# EAGLE design ROwen_main (EAGLE 7.2.0)

## Sheet 1 of 4
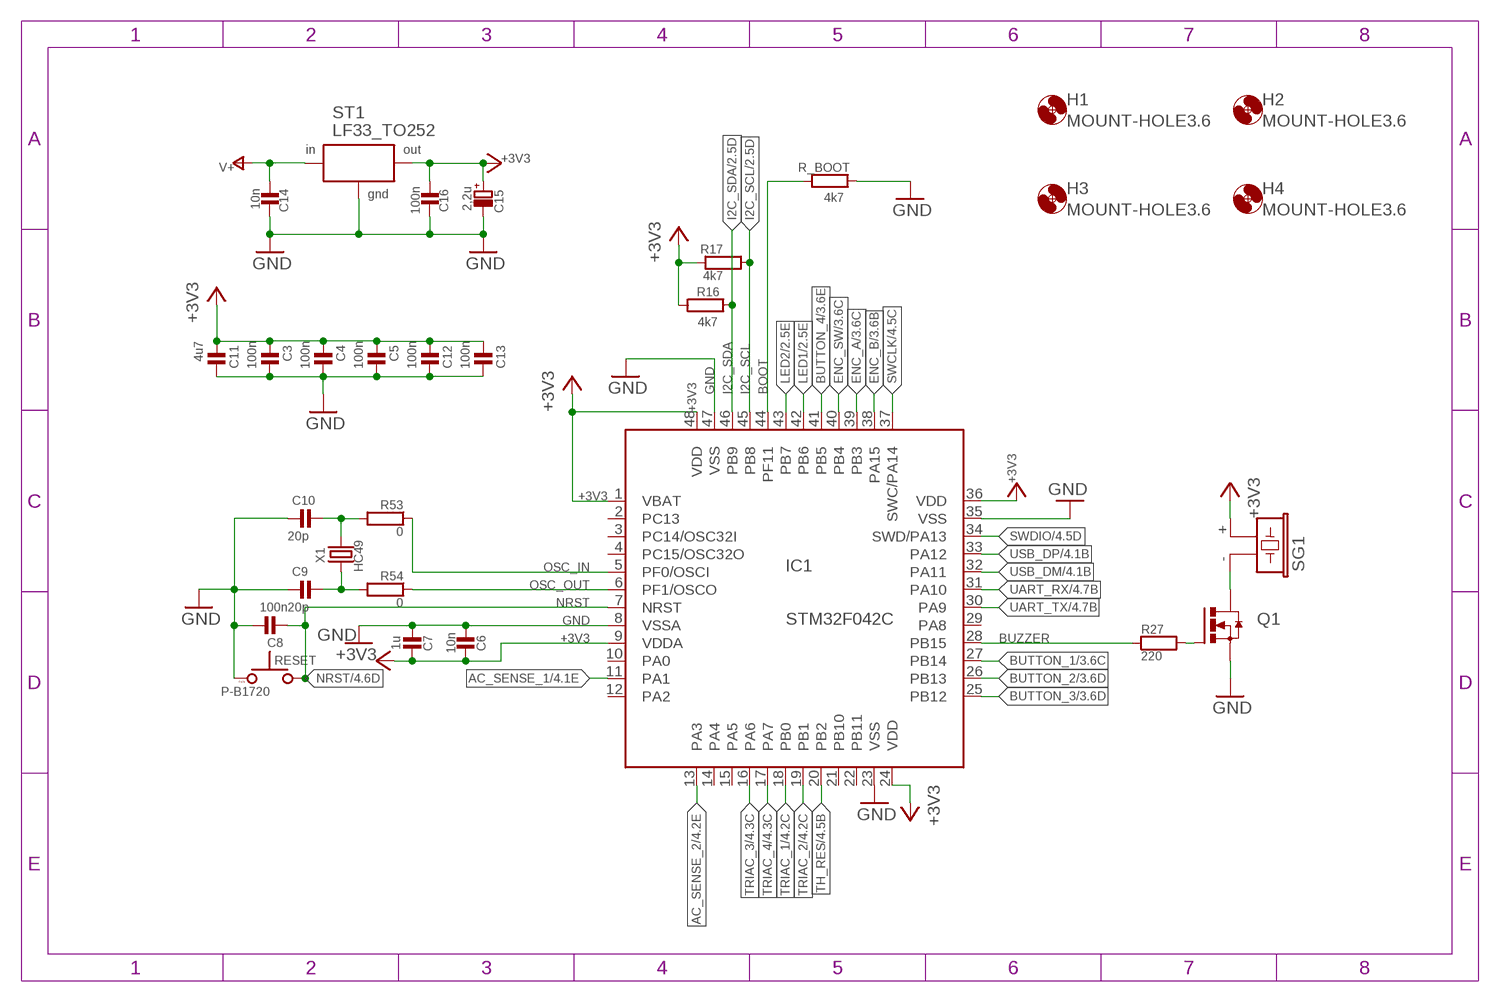
[diagram p0: schematic, sheet 1]

### Parts
C3  100n  C0603  [0603]
C4  100n  C0603  [0603]
C5  100n  C0603  [0603]
C6  10n  C0603  [0603]
C7  1u  C0603  [0603]
C8  100n  C0603  [0603]
C9  20p  C0603  [0603]
C10  20p  C0603  [0603]
C11  4u7  C0603  [0603]
C12  100n  C0603  [0603]
C13  100n  C0603  [0603]
C14  10n  C0603  [0603]
C15  2,2u  CEE5-8.5  [ER_08,5_05]
C16  100n  C0603  [0603]
H1  MOUNT-HOLE3.6  [3,6]
H2  MOUNT-HOLE3.6  [3,6]
H3  MOUNT-HOLE3.6  [3,6]
H4  MOUNT-HOLE3.6  [3,6]
IC1  STM32F042C  [LQFP48]
Q1  N-HEXFET-2D_SOT232-IRLL014N  [SOT223]
R16  4k7  R_R0603  [0603]
R17  4k7  R_R0603  [0603]
R27  220  R_R0603  [0603]
R53  0  R_R0603  [0603]
R54  0  R_R0603  [0603]
R_BOOT  4k7  R_R0603  [0603]
RESET  P-B1720  [P-B1720]
SG1  F/CM12P  [F/CM12P]
ST1  LF33_TO252  [DPACK]
X1  HC49  XHC49  [X_HC49/S]

### Nets
+3V3: C3.2 C4.2 C5.2 C6.1 C7.1 C11.2 C12.2 C13.2 C15.+ C16.2 IC1.1(VBAT) IC1.9(VDDA) IC1.24(VDD) IC1.36(VDD) IC1.48(VDD) R16.2 R17.2 SG1.+ ST1.3(OUT) ; also sheet 2,3,4
AC_SENSE_1: IC1.11(PA1) ; also sheet 4
AC_SENSE_2: IC1.13(PA3) ; also sheet 4
BOOT: IC1.44(PF11) R_BOOT.2
BUTTON_1: IC1.27(PB14) ; also sheet 3
BUTTON_2: IC1.26(PB13) ; also sheet 3
BUTTON_3: IC1.25(PB12) ; also sheet 3
BUTTON_4: IC1.41(PB5) ; also sheet 3
BUZZER: IC1.28(PB15) R27.1
ENC_A: IC1.39(PB3) ; also sheet 3
ENC_B: IC1.38(PA15) ; also sheet 3
ENC_SW: IC1.40(PB4) ; also sheet 3
GND: C3.1 C4.1 C5.1 C6.2 C7.2 C8.1 C9.2 C10.2 C11.1 C12.1 C13.1 C14.2 C15.- C16.1 IC1.8(VSSA) IC1.23(VSS) IC1.35(VSS) IC1.47(VSS) Q1.3(S) R_BOOT.1 RESET.1 ST1.2(GND) ; also sheet 2,3,4
I2C_SCL: IC1.45(PB8) R17.1 ; also sheet 2,4
I2C_SDA: IC1.46(PB9) R16.1 ; also sheet 2,4
LED1: IC1.42(PB6) ; also sheet 2
LED2: IC1.43(PB7) ; also sheet 2
N$78: Q1.2(D) Q1.4(D) SG1.-
N$79: Q1.1(G) R27.2
N$82: C9.1 R54.2 X1.1
N$85: C10.1 R53.2 X1.2
NRST: C8.2 IC1.7(NRST) RESET.2 ; also sheet 4
OSC_IN: IC1.5(PF0/OSCI) R53.1
OSC_OUT: IC1.6(PF1/OSCO) R54.1
SWCLK: IC1.37(SWC/PA14) ; also sheet 4
SWDIO: IC1.34(SWD/PA13) ; also sheet 4
TH_RES: IC1.20(PB2) ; also sheet 4
TRIAC_1: IC1.18(PB0) ; also sheet 4
TRIAC_2: IC1.19(PB1) ; also sheet 4
TRIAC_3: IC1.16(PA6) ; also sheet 4
TRIAC_4: IC1.17(PA7) ; also sheet 4
UART_RX: IC1.31(PA10) ; also sheet 4
UART_TX: IC1.30(PA9) ; also sheet 4
USB_DM: IC1.32(PA11) ; also sheet 4
USB_DP: IC1.33(PA12) ; also sheet 4
V+: C14.1 ST1.1(IN) ; also sheet 4
Unconnected: IC1.2(PC13) IC1.3(PC14/OSC32I) IC1.4(PC15/OSC32O) IC1.10(PA0) IC1.12(PA2) IC1.14(PA4) IC1.15(PA5) IC1.21(PB10) IC1.22(PB11) IC1.29(PA8) RESET.3 RESET.4

## Sheet 2 of 4
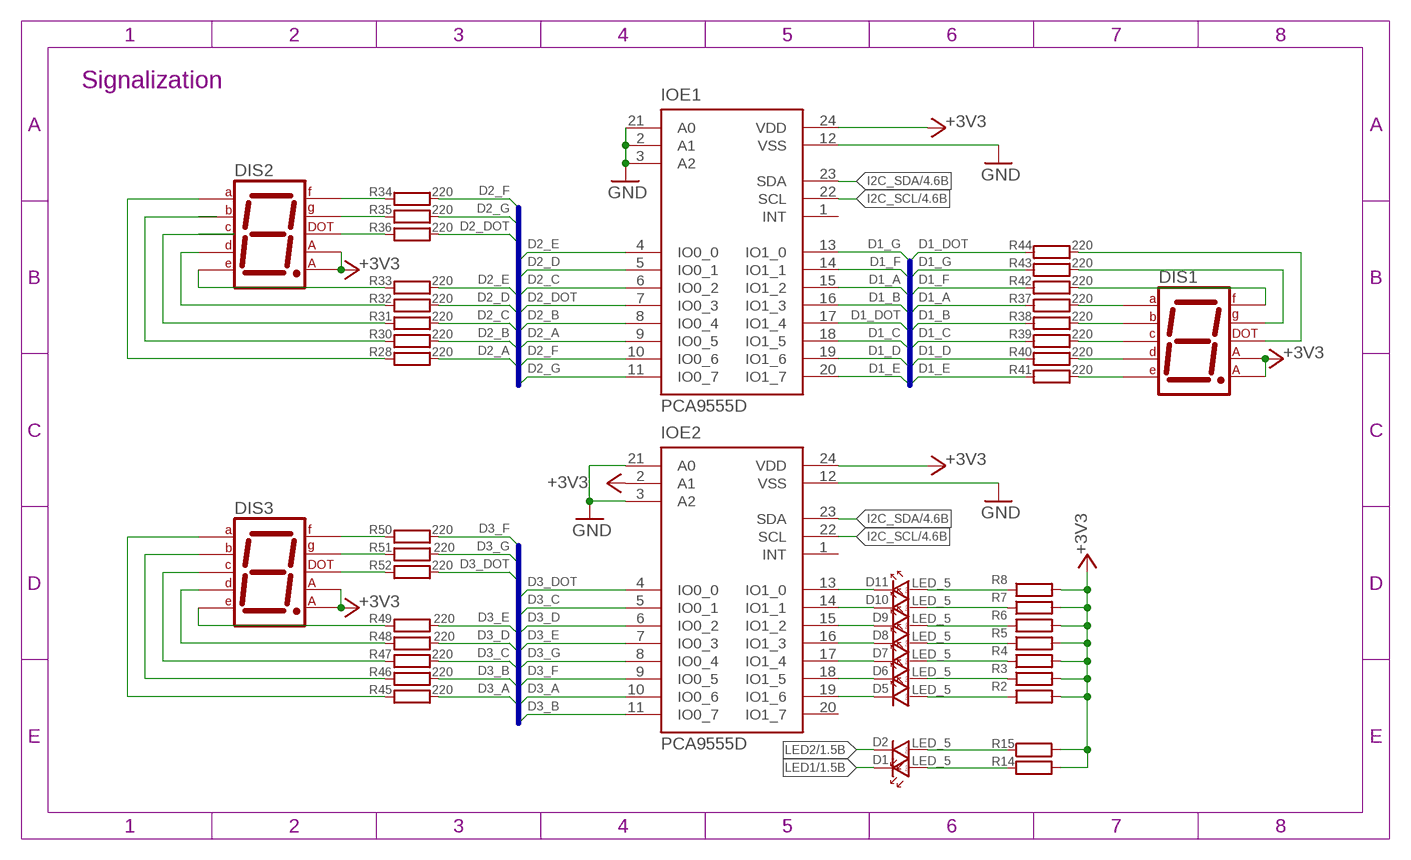
[diagram p1: schematic, sheet 2]

### Parts
D1  LED_5  [LED_5]
D2  LED_5  [LED_5]
D5  LED_5  [LED_5]
D6  LED_5  [LED_5]
D7  LED_5  [LED_5]
D8  LED_5  [LED_5]
D9  LED_5  [LED_5]
D10  LED_5  [LED_5]
D11  LED_5  [LED_5]
DIS1  7-SEGMENT-CA-0.56"  [7_SEGMENT_0.56"]
DIS2  7-SEGMENT-CA-0.56"  [7_SEGMENT_0.56"]
DIS3  7-SEGMENT-CA-0.56"  [7_SEGMENT_0.56"]
IOE1  PCA9555D  [SO24]
IOE2  PCA9555D  [SO24]
R2  R_R0603  [0603]
R3  R_R0603  [0603]
R4  R_R0603  [0603]
R5  R_R0603  [0603]
R6  R_R0603  [0603]
R7  R_R0603  [0603]
R8  R_R0603  [0603]
R14  R_R0603  [0603]
R15  R_R0603  [0603]
R28  220  R_R0603  [0603]
R30  220  R_R0603  [0603]
R31  220  R_R0603  [0603]
R32  220  R_R0603  [0603]
R33  220  R_R0603  [0603]
R34  220  R_R0603  [0603]
R35  220  R_R0603  [0603]
R36  220  R_R0603  [0603]
R37  220  R_R0603  [0603]
R38  220  R_R0603  [0603]
R39  220  R_R0603  [0603]
R40  220  R_R0603  [0603]
R41  220  R_R0603  [0603]
R42  220  R_R0603  [0603]
R43  220  R_R0603  [0603]
R44  220  R_R0603  [0603]
R45  220  R_R0603  [0603]
R46  220  R_R0603  [0603]
R47  220  R_R0603  [0603]
R48  220  R_R0603  [0603]
R49  220  R_R0603  [0603]
R50  220  R_R0603  [0603]
R51  220  R_R0603  [0603]
R52  220  R_R0603  [0603]

### Nets
+3V3: DIS1.3(CA2) DIS1.8(CA1) DIS2.3(CA2) DIS2.8(CA1) DIS3.3(CA2) DIS3.8(CA1) IOE1.24(VDD) IOE2.2(A1) IOE2.24(VDD) R2.2 R3.2 R4.2 R5.2 R6.2 R7.2 R8.2 R14.2 R15.2 ; also sheet 1,3,4
D1_A: IOE1.15(IO1_2) R37.2
D1_B: IOE1.16(IO1_3) R38.2
D1_C: IOE1.18(IO1_5) R39.2
D1_D: IOE1.19(IO1_6) R40.2
D1_DOT: IOE1.17(IO1_4) R44.2
D1_E: IOE1.20(IO1_7) R41.2
D1_F: IOE1.14(IO1_1) R42.2
D1_G: IOE1.13(IO1_0) R43.2
D2_A: IOE1.9(IO0_5) R28.2
D2_B: IOE1.8(IO0_4) R30.2
D2_C: IOE1.6(IO0_2) R31.2
D2_D: IOE1.5(IO0_1) R32.2
D2_DOT: IOE1.7(IO0_3) R36.2
D2_E: IOE1.4(IO0_0) R33.2
D2_F: IOE1.10(IO0_6) R34.2
D2_G: IOE1.11(IO0_7) R35.2
D3_A: IOE2.10(IO0_6) R45.2
D3_B: IOE2.11(IO0_7) R46.2
D3_C: IOE2.5(IO0_1) R47.2
D3_D: IOE2.6(IO0_2) R48.2
D3_DOT: IOE2.4(IO0_0) R52.2
D3_E: IOE2.7(IO0_3) R49.2
D3_F: IOE2.9(IO0_5) R50.2
D3_G: IOE2.8(IO0_4) R51.2
GND: IOE1.2(A1) IOE1.3(A2) IOE1.12(VSS) IOE1.21(A0) IOE2.3(A2) IOE2.12(VSS) IOE2.21(A0) ; also sheet 1,3,4
I2C_SCL: IOE1.22(SCL) IOE2.22(SCL) ; also sheet 1,4
I2C_SDA: IOE1.23(SDA) IOE2.23(SDA) ; also sheet 1,4
LED1: D1.K ; also sheet 1
LED2: D2.K ; also sheet 1
N$2: DIS1.7(A) R37.1
N$3: DIS1.6(B) R38.1
N$4: DIS1.4(C) R39.1
N$5: DIS1.2(D) R40.1
N$6: DIS1.1(E) R41.1
N$7: DIS1.9(F) R42.1
N$9: DIS2.7(A) R28.1
N$10: DIS2.6(B) R30.1
N$11: DIS2.4(C) R31.1
N$12: DIS2.2(D) R32.1
N$13: DIS2.1(E) R33.1
N$14: DIS2.9(F) R34.1
N$16: DIS2.10(G) R35.1
N$17: DIS3.7(A) R45.1
N$18: DIS3.6(B) R46.1
N$19: DIS3.4(C) R47.1
N$20: DIS3.2(D) R48.1
N$21: DIS3.1(E) R49.1
N$22: DIS3.9(F) R50.1
N$23: DIS3.10(G) R51.1
N$24: DIS3.5(DP) R52.1
N$36: D11.A R8.1
N$37: D10.A R7.1
N$38: D8.A R5.1
N$39: D6.A R3.1
N$40: D5.A R2.1
N$41: D7.A R4.1
N$42: D9.A R6.1
N$63: D5.K IOE2.19(IO1_6)
N$64: D6.K IOE2.18(IO1_5)
N$65: D7.K IOE2.17(IO1_4)
N$66: D8.K IOE2.16(IO1_3)
N$67: D9.K IOE2.15(IO1_2)
N$68: D10.K IOE2.14(IO1_1)
N$69: D11.K IOE2.13(IO1_0)
N$72: D2.A R15.1
N$73: D1.A R14.1
N$80: DIS1.10(G) R43.1
N$83: DIS1.5(DP) R44.1
N$84: DIS2.5(DP) R36.1
Unconnected: IOE1.1(INT) IOE2.1(INT) IOE2.20(IO1_7)

### Buses
D3_A,D3_B,D3_C,D3_D,D3_E,D3_F,D3_G,D3_DOT
D2_A,D2_B,D2_C,D2_D,D2_E,D2_F,D2_G,D2_DOT
D1_A,D1_B,D1_C,D1_D,D1_E,D1_F,D1_G,D1_DOT

### Notes on the sheet
- Signalization

## Sheet 3 of 4
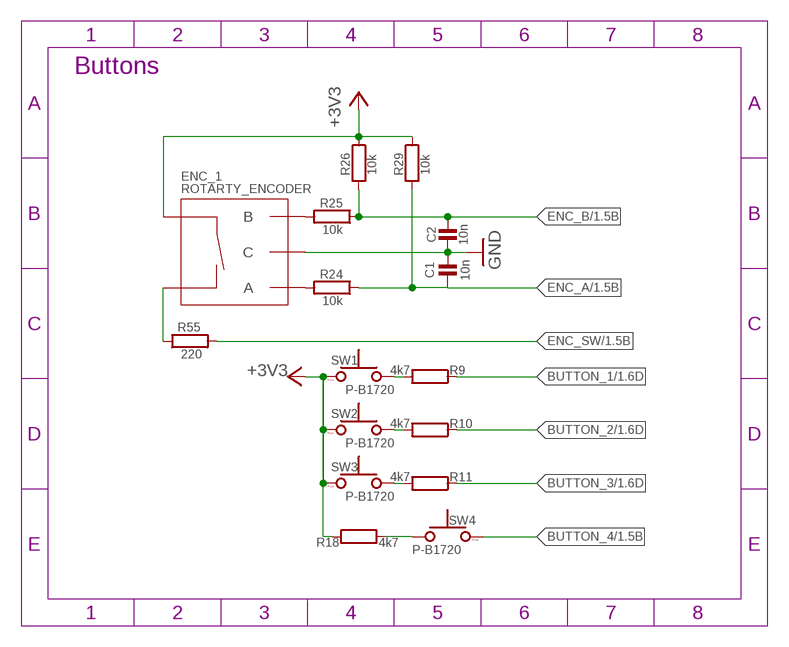
[diagram p2: schematic, sheet 3]

### Parts
C1  10n  C0603  [0603]
C2  10n  C0603  [0603]
ENC_1  ROTARTY_ENCODER  [ROTARY_ENC_PLAIN]
R9  4k7  R_R0603  [0603]
R10  4k7  R_R0603  [0603]
R11  4k7  R_R0603  [0603]
R18  4k7  R_R0603  [0603]
R24  10k  R_R0603  [0603]
R25  10k  R_R0603  [0603]
R26  10k  R_R0603  [0603]
R29  10k  R_R0603  [0603]
R55  220  R_R0603  [0603]
SW1  P-B1720  [P-B1720]
SW2  P-B1720  [P-B1720]
SW3  P-B1720  [P-B1720]
SW4  P-B1720  [P-B1720]

### Nets
+3V3: ENC_1.SW+ R18.1 R26.1 R29.1 SW1.1 SW2.1 SW3.1 ; also sheet 1,2,4
BUTTON_1: R9.1 ; also sheet 1
BUTTON_2: R10.1 ; also sheet 1
BUTTON_3: R11.1 ; also sheet 1
BUTTON_4: SW4.1 ; also sheet 1
ENC_A: C1.2 R24.1 R29.2 ; also sheet 1
ENC_B: C2.1 R25.1 R26.2 ; also sheet 1
ENC_SW: R55.2 ; also sheet 1
GND: C1.1 C2.2 ENC_1.C ; also sheet 1,2,4
N$26: R9.2 SW1.2
N$27: R10.2 SW2.2
N$28: R11.2 SW3.2
N$29: R18.2 SW4.2
N$129: ENC_1.B R25.2
N$132: ENC_1.A R24.2
N$139: ENC_1.SW- R55.1
Unconnected: SW1.3 SW1.4 SW2.3 SW2.4 SW3.3 SW3.4 SW4.3 SW4.4

### Notes on the sheet
- Buttons

## Sheet 4 of 4
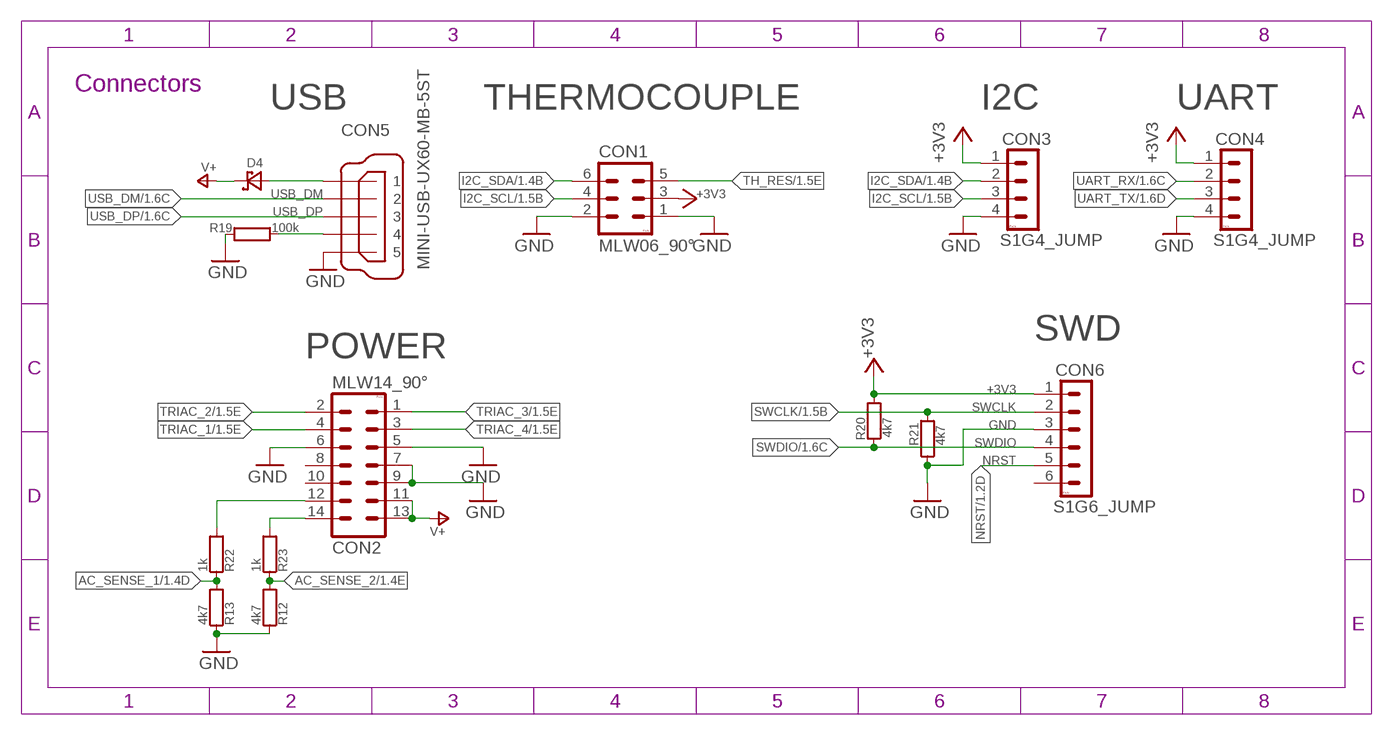
[diagram p3: schematic, sheet 4]

### Parts
CON1  MLW06_90°  [MLW06A]
CON2  MLW14_90°  [MLW14A]
CON3  S1G4_JUMP  [S1G4_JUM]
CON4  S1G4_JUMP  [S1G4_JUM]
CON5  MINI-USB-UX60-MB-5ST  [UX60-MB-5ST]
CON6  S1G6_JUMP  [S1G6_JUM]
D4  D_SCHOTKY_SMA  [D_SMA]
R12  4k7  R_R0603  [0603]
R13  4k7  R_R0603  [0603]
R19  100k  R_R0603  [0603]
R20  4k7  R_R0603  [0603]
R21  4k7  R_R0603  [0603]
R22  1k  R_R0603  [0603]
R23  1k  R_R0603  [0603]

### Nets
+3V3: CON1.3 CON3.1 CON4.1 CON6.1 R20.2 ; also sheet 1,2,3
AC_SENSE_1: R13.2 R22.1 ; also sheet 1
AC_SENSE_2: R12.2 R23.1 ; also sheet 1
GND: CON1.1 CON1.2 CON2.5 CON2.6 CON2.7 CON2.9 CON3.4 CON4.4 CON5.5 CON6.3 R12.1 R13.1 R19.1 R21.1 ; also sheet 1,2,3
I2C_SCL: CON1.4 CON3.3 ; also sheet 1,2
I2C_SDA: CON1.6 CON3.2 ; also sheet 1,2
N$8: CON5.1 D4.A
N$33: CON5.4 R19.2
NRST: CON6.5 ; also sheet 1
SINUS_A: CON2.12 R22.2
SINUS_B: CON2.14 R23.2
SWCLK: CON6.2 R21.2 ; also sheet 1
SWDIO: CON6.4 R20.1 ; also sheet 1
TH_RES: CON1.5 ; also sheet 1
TRIAC_1: CON2.4 ; also sheet 1
TRIAC_2: CON2.2 ; also sheet 1
TRIAC_3: CON2.1 ; also sheet 1
TRIAC_4: CON2.3 ; also sheet 1
UART_RX: CON4.2 ; also sheet 1
UART_TX: CON4.3 ; also sheet 1
USB_DM: CON5.2 ; also sheet 1
USB_DP: CON5.3 ; also sheet 1
V+: CON2.11 CON2.13 D4.K ; also sheet 1
Unconnected: CON2.8 CON2.10 CON6.6

### Notes on the sheet
- Connectors
- USB | THERMOCOUPLE | I2C | UART
- SWD
- POWER

## Library data of the parts
C1-C14 C16 = !discrete:C: Kondenzator
C15 = !discrete:CE: Kondenzator Elektrolyt
CON1 = !kumen:MLW06: Konektory MLW - vidlice - 6x
CON2 = !kumen:MLW14: Konektory MLW - vidlice - 14x
CON3 CON4 = #PaJa_konektory:S1G4_JUMP: Radove konektory - koliky - 4x
CON5 = !kumen:MINI-USB-: MINI USB Connector Source: http://www.hirose.co.jp/cataloge_hp/e24000019.pdf; OC_FARNELL: unknown; OC_NEWARK: unknown
CON6 = #PaJa_konektory:S1G6_JUMP: Radove konektory - koliky - 6x
D1 D2 D5-D11 = #PaJa_30:LED: LED - jednobarevna
D4 = !discrete:D_SCHOTKY: Dioda Schottkyho Typ Ur (Urpk] Uf I (Ipk] Pouzdro SD103B 30 V 200 mA DO35 BAT42 30 V 200 mA DO35 BAT43 30 V 200 mA DO35 BAT46 100 V 150 mA DO35 BAT47 20 V 350 mA DO35 BAT48 40 V 350 mA DO35 SK24 40 V (28V) 0.55V 2A (50A) DO214AA (SMB) SK26 60 V 0.65V 2A (50A) DO214AA (SMB)
DIS1-DIS3 = !kumen:7-SEGMENT-CA-*: 7-segment DISPLAY single anode, 13 mm
ENC_1 = kumen:ROTARTY_ENCODER: Simple no LED rotary encoder Example: COM-09117
H1-H4 = holes:MOUNT-HOLE: MOUNTING HOLE with drill center marker
IC1 = kumen:STM32F042C
IOE1 IOE2 = kumen:PCA9555D
Q1 = transistor-power:N-HEXFET-2D_?-*: HEXFET® Power MOSFET 2 Drain connects http://www.irf.com/product-info/datasheets/data/irll014n.pdf
R2-R55 R_BOOT = !discrete:R_: Rezistor
RESET SW1-SW4 = #PaJa_prepinace:P-B1720: µ-tlacitko
SG1 = buzzer:F/CM12P: BUZZER Source: Buerklin; OC_FARNELL: unknown; OC_NEWARK: unknown
ST1 = power_stabilizators:LF33: VERY LOW DROP VOLTAGE REGULATORS WITH INHIBIT LF33 > VERY LOW DROPOUT VOLTAGE (0.45V) > VERY LOW QUIESCENT CURRENT (TYP. > 50 ?A IN OFF MODE, 500 ?A IN ON MODE) > OUTPUT CURRENT UP TO 500 mA > INTERNAL CURRENT AND THERMAL LIMIT > ONLY 2.2 ?F FOR STABILITY > AVAILABLE IN ± 1% (AB) OR ± 2% (C) SELECTION AT 25 °C > SUPPLY VOLTAGE REJECTION: 80db (TYP.) > TEMPERATURE RANGE: -40 TO 125 °C; MPN: LF33CDT-TR; OC_FARNELL: 2112623; PACKAGE: TO252; SUPPLIER: STMICROELECTRONICS
X1 = !discrete:X: Krystal

## Board
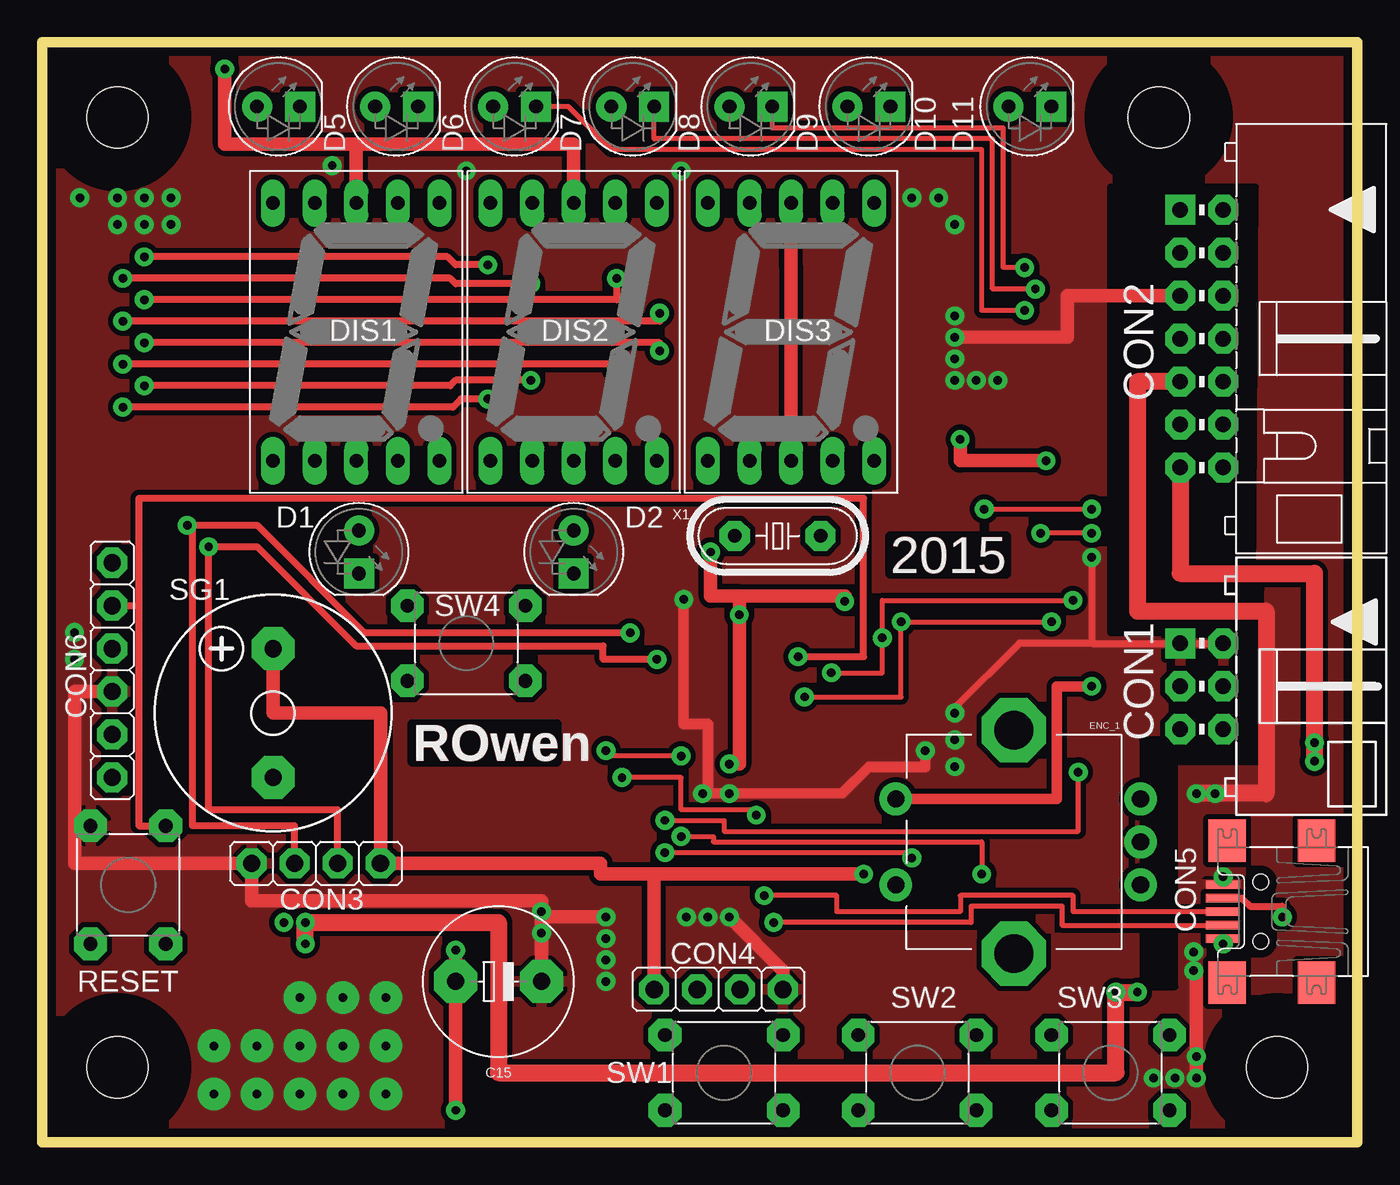
[diagram p4: board, top side]
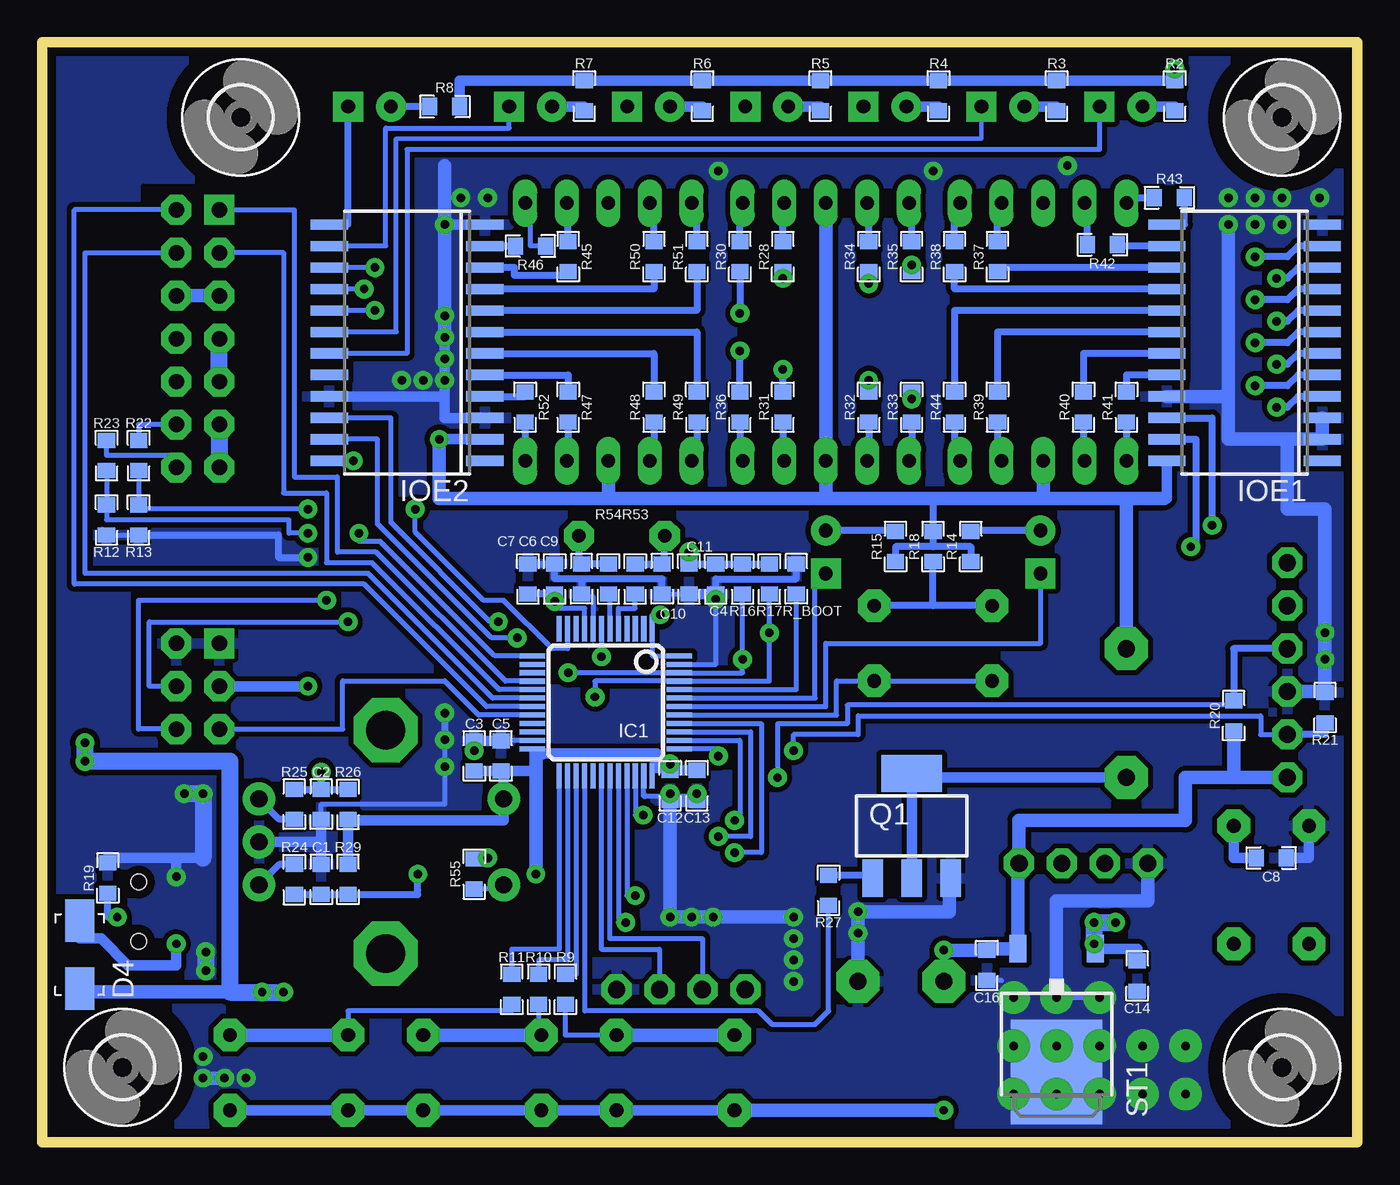
[diagram p5: board, bottom side, seen from below]

Size 77.78 x 65.08 mm. Coordinates in mm from the lower left corner, seen from the top.
Outline: 0,0 77.78,0 77.78,65.08 0,65.08 0,0
Copper layers (1*16): Top 0.035mm / dielectric 1.5mm / Bottom 0.035mm
Design rules "EagleRules *": minimum track width 7mil, minimum drill 0.5mm, track to track 7mil, track to pad 7mil, pad to pad 7mil, via to via 7mil, smd to smd 0mil, copper to edge 20mil, drill to drill 10mil, minimum pad ring 12mil, minimum via ring 12mil, stop-mask expansion 2mil, vias tented up to drill 25mil, thermal gap 10mil

### Footprints (pad centres in the part's own frame; a part is rotated, then mirrored left to right if it is on the bottom)
0603 = smd 0.889 x 1.016: 1 -0.889,0; 2 0.889,0
ER_08,5_05 = drill 1.016 pad 2.54 octagon: + -2.54,0; - 2.54,0
MLW06A = drill 0.914 pad 1.778 square: 1 -2.54,-1.27 | drill 0.914 pad 1.778 octagon: 2 -2.54,1.27; 3 0,-1.27; 4 0,1.27; 5 2.54,-1.27; 6 2.54,1.27
MLW14A = drill 0.914 pad 1.778 square: 1 -7.62,-1.27 | drill 0.914 pad 1.778 octagon: 2 -7.62,1.27; 3 -5.08,-1.27; 4 -5.08,1.27; 5 -2.54,-1.27; 6 -2.54,1.27; 7 0,-1.27; 8 0,1.27; 9 2.54,-1.27; 10 2.54,1.27; 11 5.08,-1.27; 12 5.08,1.27; 13 7.62,-1.27; 14 7.62,1.27
S1G4_JUM = drill 1.016 pad 1.778 octagon: 1 -3.81,0; 2 -1.27,0; 3 1.27,0; 4 3.81,0
UX60-MB-5ST = smd 2 x 0.5: 1 2.25,1.6; 2 2.25,0.8; 3 2.25,0; 4 2.25,-0.8; 5 2.25,-1.6 | smd 2.2 x 2.5: M1 -3.3,-4.2; M2 -3.3,4.2; M3 2,4.2; M4 2,-4.2 | hole 0.9: 0,-1.75; 0,1.75
S1G6_JUM = drill 1.016 pad 1.778 octagon: 1 -6.35,0; 2 -3.81,0; 3 -1.27,0; 4 1.27,0; 5 3.81,0; 6 6.35,0
LED_5 = drill 0.813 pad 1.778: A -1.27,0 | drill 0.813 pad 1.778 square: K 1.27,0
D_SMA = smd 2.515 x 1.702: A 2,0; K -2,0
7_SEGMENT_0.56" = drill 0.8 long: 1 0,0; 2 2.46,0; 3 4.92,0; 4 7.38,0; 5 9.84,0; 6 9.84,15.24; 7 7.38,15.24; 8 4.92,15.24; 9 2.46,15.24; 10 0,15.24
ROTARY_ENC_PLAIN = drill 1.016 pad 1.93: A 7.493,-2.54; B 7.493,2.54; C 7.493,0; SW+ -6.985,2.54; SW- -6.985,-2.54 | drill 2.286 pad 3.81 octagon: P$3 0,6.604; P$4 0,-6.604
3,6 = hole 3.6: 0,0
LQFP48 = smd 0.3 x 1.5: 1 -2.75,-4.35; 2 -2.25,-4.35; 3 -1.75,-4.35; 4 -1.25,-4.35; 5 -0.75,-4.35; 6 -0.25,-4.35; 7 0.25,-4.35; 8 0.75,-4.35; 9 1.25,-4.35; 10 1.75,-4.35; 11 2.25,-4.35; 12 2.75,-4.35; 25 2.75,4.35; 26 2.25,4.35; 27 1.75,4.35; 28 1.25,4.35; 29 0.75,4.35; 30 0.25,4.35; 31 -0.25,4.35; 32 -0.75,4.35; 33 -1.25,4.35; 34 -1.75,4.35; 35 -2.25,4.35; 36 -2.75,4.35 | smd 1.5 x 0.3: 13 4.35,-2.75; 14 4.35,-2.25; 15 4.35,-1.75; 16 4.35,-1.25; 17 4.35,-0.75; 18 4.35,-0.25; 19 4.35,0.25; 20 4.35,0.75; 21 4.35,1.25; 22 4.35,1.75; 23 4.35,2.25; 24 4.35,2.75; 37 -4.35,2.75; 38 -4.35,2.25; 39 -4.35,1.75; 40 -4.35,1.25; 41 -4.35,0.75; 42 -4.35,0.25; 43 -4.35,-0.25; 44 -4.35,-0.75; 45 -4.35,-1.25; 46 -4.35,-1.75; 47 -4.35,-2.25; 48 -4.35,-2.75
SO24 = smd 0.6 x 2.2: 1 -6.985,-4.6; 2 -5.715,-4.6; 3 -4.445,-4.6; 4 -3.175,-4.6; 5 -1.905,-4.6; 6 -0.635,-4.6; 7 0.635,-4.6; 8 1.905,-4.6; 9 3.175,-4.6; 10 4.445,-4.6; 11 5.715,-4.6; 12 6.985,-4.6; 13 6.985,4.6; 14 5.715,4.6; 15 4.445,4.6; 16 3.175,4.6; 17 1.905,4.6; 18 0.635,4.6; 19 -0.635,4.6; 20 -1.905,4.6; 21 -3.175,4.6; 22 -4.445,4.6; 23 -5.715,4.6; 24 -6.985,4.6
SOT223 = smd 1.219 x 2.235: 1 -2.311,-3.099; 2 0,-3.099; 3 2.311,-3.099 | smd 3.6 x 2.2: 4 0,3.099
P-B1720 = drill 0.813 pad 1.93 octagon: 1 -3.493,-2.223; 2 -3.493,2.223; 3 3.493,-2.223; 4 3.493,2.223
F/CM12P = drill 1.016 pad 2.54 octagon: + 3.81,0; - -3.81,0
DPACK = smd 1 x 1.6: 1 -2.28,-4.8; 3 2.28,-4.8 | smd 5.4 x 6.2: 2 0,2.5
X_HC49/S = drill 0.8 pad 1.778 octagon: 1 -2.54,0; 2 2.54,0

### Placement (x,y rotation side)
C1  61.28,15.56 270 bottom
C2  61.28,20 270 bottom
C3  52.23,22.86 270 bottom
C4  37.94,33.34 90 bottom
C5  50.64,22.86 270 bottom
C6  47.47,33.34 90 bottom
C7  49.05,33.34 90 bottom
C8  5.08,16.83 180 bottom
C9  45.88,33.34 270 bottom
C10  41.12,33.34 270 bottom
C11  39.53,33.34 90 bottom
C12  40.64,21.11 90 bottom
C13  39.05,21.11 90 bottom
C14  13.02,9.84 270 bottom
C15  26.99,9.52 0 top
C16  21.91,10.48 90 bottom
CON1  68.58,26.99 270 top
CON2  68.58,47.55 270 top
CON3  16.19,16.51 180 top
CON4  40.01,9.05 0 top
CON5  72.07,13.65 180 top
CON6  4.13,27.94 90 top
D1  18.73,34.92 270 top
D2  31.43,34.92 270 top
D4  75.56,11.11 90 bottom
D5  13.97,61.28 0 top
D6  20.95,61.28 0 top
D7  27.94,61.28 0 top
D8  34.92,61.28 0 top
D9  41.91,61.28 0 top
D10  48.9,61.28 0 top
D11  58.42,61.28 0 top
DIS1  13.65,40.32 0 top
DIS2  26.51,40.32 0 top
DIS3  39.37,40.32 0 top
ENC_1  57.47,17.78 0 top
H1  4.45,4.45 0 bottom
H2  66.04,60.64 0 bottom
H3  4.45,60.64 0 bottom
H4  73.03,4.45 0 bottom
IC1  44.45,26.04 180 bottom
IOE1  6.67,47.31 90 bottom
IOE2  56.2,47.31 90 bottom
Q1  26.35,18.73 0 bottom
R2  10.79,61.91 90 bottom
R3  17.78,61.91 90 bottom
R4  24.77,61.91 90 bottom
R5  31.75,61.91 90 bottom
R6  38.73,61.91 90 bottom
R7  45.72,61.91 90 bottom
R8  53.98,61.28 0 bottom
R9  46.83,9.05 270 bottom
R10  48.42,9.05 270 bottom
R11  50.01,9.05 270 bottom
R12  73.98,36.83 90 bottom
R13  72.07,36.83 90 bottom
R14  22.86,35.24 270 bottom
R15  27.3,35.24 270 bottom
R16  36.35,33.34 90 bottom
R17  34.77,33.34 90 bottom
R18  25.08,35.24 270 bottom
R19  73.9,15.64 270 bottom
R20  7.3,25.24 270 bottom
R21  1.91,25.72 270 bottom
R22  72.07,40.64 90 bottom
R23  73.98,40.64 90 bottom
R24  62.87,15.56 90 bottom
R25  62.87,20 270 bottom
R26  59.69,20 90 bottom
R27  31.27,14.92 90 bottom
R28  33.97,52.39 270 bottom
R29  59.69,15.56 270 bottom
R30  36.51,52.39 270 bottom
R31  33.97,43.5 90 bottom
R32  28.89,43.5 90 bottom
R33  26.35,43.5 90 bottom
R34  28.89,52.39 270 bottom
R35  26.35,52.39 270 bottom
R36  36.51,43.5 90 bottom
R37  21.27,52.39 270 bottom
R38  23.81,52.39 270 bottom
R39  21.27,43.5 90 bottom
R40  16.19,43.5 90 bottom
R41  13.65,43.5 90 bottom
R42  15.08,53.1 0 bottom
R43  11.11,55.88 0 bottom
R44  23.81,43.5 90 bottom
R45  46.67,52.39 270 bottom
R46  48.9,53.02 180 bottom
R47  46.67,43.5 90 bottom
R48  41.59,43.5 90 bottom
R49  39.05,43.5 90 bottom
R50  41.59,52.39 270 bottom
R51  39.05,52.39 270 bottom
R52  49.21,43.5 90 bottom
R53  42.7,33.34 90 bottom
R54  44.29,33.34 90 bottom
R55  52.23,15.87 90 bottom
R_BOOT  33.18,33.34 270 bottom
RESET  5.08,15.24 270 top
SG1  13.65,25.4 90 top
ST1  17.78,6.67 180 bottom
SW1  40.32,4.13 0 top
SW2  51.75,4.13 0 top
SW3  63.18,4.13 0 top
SW4  25.08,29.53 0 top
X1  43.5,35.88 180 top

### Tracks (layer width: path | path; a pad name or v marks a point on that pad's centre or on a via)
+3V3  (via drill 0.5)
  Top 0.61: v62.07,26.99 60.01,26.99 60.01,20.32 ENC_1.SW+
  Top 0.813: 18.57,59.06 10.79,59.06 v10.79,63.5 | 41.22,32.32 v41.22,31.21 41.22,22.38 v40.64,22.38 | SG1.+ 13.65,25.4 20,25.4 CON3.1 33.02,16.51 33.02,15.87 36.2,15.87 | v24.45,11.37 C15.+ v24.45,1.91 | 44.29,48.58 44.29,51.75 DIS3.8 | 44.29,48.58 44.29,47.94 | DIS1.8 18.57,59.06 | v59.37,40.32 54.29,40.32 v54.29,41.59 | 41.22,32.32 39.53,32.32 v39.53,34.92 | 41.22,32.32 47.47,32.32 v47.47,32 | 18.57,59.06 31.43,59.06 DIS2.8 | DIS3.3 44.29,48.58 | 36.2,15.87 v48.58,15.87 | CON4.1 36.2,15.87
  Bottom 0.305: 40.13,28.78 IC1.48 41.7,28.78 IC1.1 41.7,31.21 v41.22,31.21 | v40.64,22.38 C12.2 41.7,22 IC1.36 | IC1.24 48.58,23.28 48.58,23.02 | 48.58,21.97 48.58,22.23 | IOE2.24 v59.37,40.32 | v39.53,34.92 C11.2 | C6.1 v47.47,32 47.47,31.59 45.7,31.59 IC1.9
  Bottom 0.406: C11.2 C4.2 R16.2 R17.2 | 25.08,35.24 22.86,35.24 R14.2 | 25.08,35.24 27.3,35.24 R15.2 | C6.1 C7.1 | 59.69,19.05 R26.1 | 25.08,38.1 R18.1 25.08,35.24
  Bottom 0.61: SW1.1 SW2.1 SW3.1 66.67,1.91 | R2.2 R3.2 R4.2 31.43,62.8 | R5.2 R6.2 R7.2 53.09,62.8 R8.2 | IOE1.24 11.27,38.1 11.43,38.1 | v54.29,41.59 IOE2.2 | C13.2 C12.2 | R29.1 59.69,19.05 50.48,19.05 ENC_1.SW+ 50.48,21.97 C5.2 | C3.2 C5.2 | 41.43,22.38 41.43,23.02 48.26,23.02 | C5.2 48.58,21.97 | v62.07,26.99 CON1.3
  Bottom 0.813: 13.65,38.1 18.57,38.1 | 18.57,38.1 25.08,38.1 31.43,38.1 | 13.65,38.1 11.43,38.1 | 13.65,38.1 SG1.+ | CON6.1 7.3,21.59 | R20.2 7.3,21.59 | 7.3,21.59 10.16,21.59 10.16,19.05 20,19.05 CON3.1 20.06,16.51 ST1.3 21.91,11.47 C16.2 v24.45,11.37 | v48.58,15.87 48.58,22.23 48.58,23.02 48.26,23.02 | SW1.1 v24.45,1.91 | 31.43,62.8 R5.2 | v10.79,63.5 R2.2 | v40.64,22.38 41.43,22.38 | DIS1.3 18.57,38.1 | DIS3.3 44.29,38.1 | 44.29,38.1 54.29,38.1 v54.29,41.59 | DIS3.8 | 44.29,38.1 31.43,38.1 | DIS2.8 31.43,47.94 DIS2.3 31.43,38.1
AC_SENSE_1  (via drill 0.5)
  Top 0.305: v55.72,37.46 v62.07,37.46
  Bottom 0.305: IC1.11 46.7,29.21 47.62,29.21 50.48,32.07 51.67,32.07 55.72,36.12 v55.72,37.46 | v62.07,37.46 72.07,37.46 R13.2 R22.1
AC_SENSE_2  (via drill 0.5)
  Top 0.305: v62.07,36.04 v59.05,36.04
  Bottom 0.305: v62.07,36.04 63.18,36.04 63.18,36.83 73.98,36.83 R12.2 R23.1 | IC1.13 51.01,28.78 57.78,35.56 59.05,35.56 v59.05,36.04
BOOT
  Bottom 0.305: IC1.44 33.18,26.78 R_BOOT.2
BUTTON_1
  Bottom 0.305: IC1.27 46.2,9.94 R9.1
BUTTON_2
  Bottom 0.305: IC1.26 46.7,10.8 48.42,10.8 R10.1
BUTTON_3
  Bottom 0.305: IC1.25 47.2,11.43 50.01,11.43 R11.1
BUTTON_4
  Bottom 0.305: IC1.41 30.8,25.28 30.8,27.3 SW4.1
BUZZER
  Bottom 0.305: IC1.28 45.7,7.78 35.4,7.78 34.61,6.99 32.07,6.99 31.27,7.78 R27.1
D1_A
  Bottom 0.406: IOE1.15 21.27,51.75 R37.2
D1_B
  Bottom 0.406: IOE1.16 23.81,50.48 R38.2
D1_C
  Bottom 0.406: IOE1.18 21.27,47.94 R39.2
D1_D
  Bottom 0.406: IOE1.19 16.19,46.67 R40.2
D1_DOT
  Bottom 0.406: IOE1.17 23.81,49.21 R44.2
D1_E
  Bottom 0.406: IOE1.20 13.65,45.4 R41.2
D1_F
  Bottom 0.406: IOE1.14 14.19,53.02 R42.2
D1_G
  Bottom 0.406: IOE1.13 10.22,54.29 R43.2
D2_A  (via drill 0.5)
  Top 0.406: v33.97,51.12 33.97,49.85 v6.03,49.85
  Bottom 0.406: v6.03,49.85 4.13,49.85 3.49,50.48 IOE1.9 | R28.2 v33.97,51.12
D2_B  (via drill 0.5)
  Top 0.406: v36.51,49.05 36.51,48.58 v4.76,48.58
  Bottom 0.406: v4.76,48.58 4.13,48.58 3.49,49.21 IOE1.8 | 36.51,51.75 R30.2 v36.51,49.05
D2_C  (via drill 0.5)
  Top 0.406: v33.97,45.72 33.97,46.04 v4.76,46.04
  Bottom 0.406: v4.76,46.04 4.13,46.04 3.49,46.67 IOE1.6 | R31.2 v33.97,45.72
D2_D  (via drill 0.5)
  Top 0.406: v28.89,45.09 24.45,45.09 24.13,44.77 v6.03,44.77
  Bottom 0.406: v6.03,44.77 4.13,44.77 3.49,45.4 IOE1.5 | R32.2 v28.89,45.09
D2_DOT  (via drill 0.5)
  Top 0.406: v36.51,46.83 36.51,47.31 v6.03,47.31
  Bottom 0.406: v6.03,47.31 4.13,47.31 3.49,47.94 IOE1.7 | R36.2 v36.51,46.83
D2_E  (via drill 0.5)
  Top 0.406: v26.35,43.97 24.77,43.97 24.29,43.5 v4.76,43.5
  Bottom 0.406: v4.76,43.5 4.13,43.5 3.49,44.13 IOE1.4 | R33.2 v26.35,43.97
D2_F  (via drill 0.5)
  Top 0.406: v28.89,50.8 24.45,50.8 24.13,51.12 v4.76,51.12
  Bottom 0.406: v4.76,51.12 4.13,51.12 3.49,51.75 IOE1.10 | R34.2 v28.89,50.8
D2_G  (via drill 0.5)
  Top 0.406: v26.35,51.91 24.45,51.91 23.97,52.39 v6.03,52.39
  Bottom 0.406: v6.03,52.39 4.13,52.39 3.49,53.02 IOE1.11 | 26.35,51.83 R35.2 v26.35,51.91
D3_A
  Bottom 0.406: R45.2 46.67,51.28 49.85,51.28 49.85,51.75 IOE2.10
D3_B
  Bottom 0.406: R46.2 IOE2.11
D3_C
  Bottom 0.406: IOE2.5 46.67,45.4 R47.2
D3_D
  Bottom 0.406: IOE2.6 41.59,46.67 R48.2
D3_DOT
  Bottom 0.406: IOE2.4 49.21,44.13 R52.2
D3_E
  Bottom 0.406: IOE2.7 39.05,47.94 R49.2
D3_F
  Bottom 0.406: R50.2 41.59,50.48 IOE2.9
D3_G
  Bottom 0.406: R51.2 39.05,49.21 IOE2.8
ENC_A  (via drill 0.5)
  Top 0.305: v37.78,18.1 39.69,18.1 39.69,17.78 55.56,17.78 v55.56,15.87
  Bottom 0.305: IC1.39 35.88,24.28 35.88,18.1 v37.78,18.1
  Bottom 0.406: v55.56,15.87 55.56,14.92 55.56,14.67 R29.2 C1.2 R24.1
ENC_B  (via drill 0.5)
  Top 0.305: v36.83,19.05 40.32,19.05 40.32,18.42 61.28,18.42 v61.28,21.91
  Bottom 0.305: IC1.38 36.51,23.78 36.51,19.05 v36.83,19.05
  Bottom 0.406: R25.1 C2.1 | C2.1 R26.2 | v61.28,21.91 C2.1
ENC_SW  (via drill 0.5)
  Top 0.305: v36.83,17.14 51.44,17.14 v51.44,16.83
  Bottom 0.305: IC1.40 35.24,24.78 35.24,17.14 v36.83,17.14
  Bottom 0.406: R55.2 51.44,16.76 v51.44,16.83
GND  (via drill 0.5, 0.5 pad 1.93)
  Top 0.406: 69.82,15.24 CON5.5 69.85,15.25 v69.85,15.72 | v62.07,34.61 62.07,29.53 | 62.07,29.53 57.78,29.53 53.98,25.72 v53.98,25.4 | 62.07,29.53 CON1.1 CON1.2
  Top 0.61: v37.94,32.12 37.94,24.76 39.37,24.76 39.37,20.64 v39.05,20.64 47.31,20.64 48.9,22.23 52.23,22.23 v52.23,23.18 | RESET.1 1.91,18.73
  Top 0.813: v29.53,13.65 C15.- 29.53,8.89 | CON6.3 1.91,26.67 1.91,18.73 1.91,16.51 CON3.4 12.38,14.29 29.53,14.29 v29.53,13.65 | CON2.5 60.64,50.09 60.64,47.63 v53.98,47.63 | CON4.4 43.81,10.16 v40.64,13.33 | v29.53,13.65 29.84,13.33 v33.34,13.33 | v68.1,10.16 68.26,10.16 v68.26,3.81
  Top 1.016: CON2.9 64.77,45.01 64.77,31.43 72.39,31.43 72.39,20.64 v69.37,20.64 v68.26,20.64
  Bottom 0.305: C9.2 45.88,32.31 45.2,32.31 IC1.8 | IC1.47 37.94,28.28 v37.94,32.12 C4.1 | IC1.23 50.64,23.78 C5.1 | v39.05,20.64 C13.1 | C2.2 61.28,20 53.98,20 v53.98,23.81 | 16.51,5.08 16.51,3.18 | 21.02,9.59 C16.1 | v17.78,8.57 v15.24,8.57 | R12.1 R13.1 | C10.2 C11.1 | C12.1 40.64,20.32 40.8,20.48 42.2,20.48 IC1.35
  Bottom 0.406: 45.88,33.34 41.12,33.34 C10.2 41.12,32.54 | 45.88,33.34 C9.2 | R_BOOT.1 33.18,33.34 37.94,33.34 C4.1 | C7.2 C6.2 47.47,33.34 45.88,33.34 | R13.1 63.82,35.94 63.82,34.61 v62.07,34.61 | v53.98,25.4 v53.98,23.81
  Bottom 0.61: v53.98,47.63 53.98,44.13 | 53.98,44.13 IOE2.21 61.28,44.13 | Q1.3 24.13,15.63 | IOE2.3 53.98,42.86 53.98,44.13 | IOE2.12 v53.98,54.29 | C4.1 C11.1 | v52.23,23.18 C3.1 C5.1 | C1.1 61.28,17.78 | 61.28,17.78 C2.2 | ENC_1.C 61.28,17.78 | v69.85,15.72 69.85,16.83 | 69.85,16.83 73.9,16.83 R19.1 | 69.85,16.83 68.26,16.83 | C8.1 2.86,16.83 RESET.1
  Bottom 0.813: CON2.5 CON2.6 | 4.13,41.59 7.62,41.59 7.62,44.13 | 4.13,41.59 4.13,37.46 1.91,37.46 R21.1 1.91,26.67 CON6.3 | 7.62,44.13 v7.62,54.29 | 4.13,41.59 IOE1.2 IOE1.3 | IOE1.21 7.62,44.13 | v17.78,8.57 17.78,14.29 12.38,14.29 CON3.4 | 24.13,15.63 24.13,13.65 v29.53,13.65 C15.- | C13.1 C12.1 v40.64,13.33 v33.34,13.33 | 53.98,57.78 v53.98,54.29 v53.98,47.63 | v68.26,3.81 v66.99,3.81
  Bottom 1.016: CON2.9 CON2.7 | v69.37,20.64 v68.26,20.64 68.26,16.83 | v68.1,11.27 v68.1,10.16
  other vias: 15.24,5.71 17.78,5.71 10.16,5.71 12.7,2.86 12.7,5.71 20.32,5.71 20.32,8.57 15.24,2.86 17.78,2.86 20.32,2.86 10.16,2.86 68.26,5.08 65.72,3.81 53.98,46.35 53.98,45.09 55.24,45.09 56.52,45.09 53.98,48.89 51.44,55.88 53.02,55.88 2.22,55.88 4.45,54.29 6.03,54.29 1.91,28.57 1.91,30.16 29.53,12.38 33.34,12.06 33.34,10.79 33.34,9.52 39.37,13.33 38.1,13.33 53.98,22.23 25.08,57.47 37.78,57.47 17.14,57.78 40.64,20.64 4.45,55.88 6.03,55.88 7.62,55.88
  pour Top (isolate 0.305): 0,65.09 77.79,65.09 77.47,13.65 77.47,0 0,0
  pour Bottom (isolate 0.305): 0,65.09 77.47,65.09 77.47,0 0,0
  pour Bottom (rank 2, no thermals): 14.29,9.52 14.29,0.64 21.27,0.64 21.27,9.52
I2C_SCL  (via drill 0.5)
  Top 0.305: v45.09,26.35 50.8,26.35 v50.8,30.8 v59.69,30.8
  Top 0.406: CON3.3 14.92,18.73 8.89,18.73 8.89,36.51 | v34.77,30.14 34.77,30.16 19.05,30.16 12.7,36.51 8.89,36.51 | v8.57,36.51 8.89,36.51
  Bottom 0.305: IOE2.22 57.15,42.86 57.15,36.67 51.28,30.8 v50.8,30.8 | R17.1 v34.77,30.14 34.77,27.28 IC1.45 45.09,27.28 v45.09,26.35 | CON1.4 71.44,26.99 71.44,30.8 v59.69,30.8
  Bottom 0.406: IOE1.22 8.57,42.86 v8.57,36.51
I2C_SDA  (via drill 0.5)
  Top 0.305: v46.67,27.78 49.69,27.78 v49.69,29.85 49.69,32.07 v60.96,32.07
  Top 0.406: CON3.2 17.46,19.69 9.84,19.69 v9.84,35.24 12.7,35.24 18.57,29.37 33.18,29.37 33.18,28.57 v36.35,28.57
  Bottom 0.305: R16.1 v36.35,28.57 36.35,27.78 IC1.46 v46.67,27.78 | IOE2.23 57.94,41.59 57.94,36.59 51.2,29.85 v49.69,29.85 | CON1.6 72.07,24.45 72.07,32.07 v60.96,32.07
  Bottom 0.406: IOE1.23 9.53,41.59 9.53,35.24 v9.84,35.24
LED1
  Bottom 0.305: D1.K 18.73,29.53 31.43,29.53 31.43,25.78 IC1.42
LED2
  Bottom 0.305: D2.K 32.07,33.65 32.07,26.28 IC1.43
N$2
  Bottom 0.406: R37.1 21.27,55.56 DIS1.7
N$3
  Bottom 0.406: R38.1 23.81,55.56 DIS1.6
N$4
  Bottom 0.406: R39.1 21.27,40.32 DIS1.4
N$5
  Bottom 0.406: R40.1 16.19,40.32 DIS1.2
N$6
  Bottom 0.406: R41.1 DIS1.1
N$7
  Bottom 0.406: R42.1 15.97,55.56 DIS1.9
N$8  (via drill 0.5)
  Top 0.406: CON5.1 69.82,11.75 v69.85,11.75
  Bottom 0.61: v69.85,11.75 69.85,10.48 72.71,10.48 74.3,12.07 75.56,12.07 D4.A
N$9
  Bottom 0.406: R28.1 33.97,55.56 DIS2.7
N$10
  Bottom 0.406: R30.1 36.51,55.56 DIS2.6
N$11
  Bottom 0.406: R31.1 33.97,40.32 DIS2.4
N$12
  Bottom 0.406: R32.1 28.89,40.32 DIS2.2
N$13
  Bottom 0.406: R33.1 26.35,40.32 DIS2.1
N$14
  Bottom 0.406: R34.1 28.89,55.56 DIS2.9
N$16
  Bottom 0.406: R35.1 26.35,55.56 DIS2.10
N$17
  Bottom 0.406: R45.1 46.67,55.56 DIS3.7
N$18
  Bottom 0.305: R46.1 48.9,53.02 48.9,55.56 DIS3.6
N$19
  Bottom 0.406: R47.1 46.67,40.32 DIS3.4
N$20
  Bottom 0.406: R48.1 41.59,40.32 DIS3.2
N$21
  Bottom 0.406: R49.1 39.05,40.32 DIS3.1
N$22
  Bottom 0.406: R50.1 41.59,55.56 DIS3.9
N$23
  Bottom 0.406: R51.1 39.05,55.56 DIS3.10
N$24
  Bottom 0.406: R52.1 DIS3.5
N$26
  Bottom 0.305: 43.81,6.35 46.83,6.35 R9.2
  Bottom 0.813: SW1.2 43.81,6.35
N$27
  Bottom 0.305: R10.2 48.42,6.35
  Bottom 0.813: SW2.2 48.42,6.35 55.24,6.35
N$28
  Bottom 0.305: R11.2 50.01,7.78 59.69,7.78 SW3.2
  Bottom 0.813: SW3.2 66.67,6.35
N$29
  Bottom 0.406: SW4.2 25.08,31.75 | 25.08,31.75 R18.2 | 25.08,31.75 28.57,31.75
N$33  (via drill 0.5)
  Top 0.406: CON5.4 70.95,14.45 71.44,13.97 73.34,13.97 v73.34,13.33
  Bottom 0.406: v73.34,13.33 73.9,13.33 R19.2
N$36
  Bottom 0.406: R8.1 D11.A
N$37
  Bottom 0.61: D10.A 45.72,61.28 R7.1
N$38
  Bottom 0.61: D8.A 31.75,61.28 R5.1
N$39
  Bottom 0.61: D6.A 17.78,61.28 R3.1
N$40
  Bottom 0.61: D5.A 10.79,61.28 R2.1
N$41
  Bottom 0.61: D7.A 24.77,61.28 R4.1
N$42
  Bottom 0.61: D9.A 38.73,61.28 R6.1
N$63
  Bottom 0.305: D5.K 15.24,58.74 56.2,58.74 56.2,46.67 IOE2.19
N$64
  Bottom 0.254: 56.83,59.37 22.23,59.37 D6.K
  Bottom 0.305: 56.83,59.37 56.83,47.94 IOE2.18
N$65  (via drill 0.5)
  Top 0.305: v58.1,49.21 55.56,49.21 55.56,58.74 33.66,58.74 31.11,61.28 D7.K
  Bottom 0.305: v58.1,49.21 IOE2.17
N$66  (via drill 0.5)
  Top 0.305: v58.74,50.48 56.2,50.48 56.2,59.37 36.2,59.37 D8.K
  Bottom 0.305: v58.74,50.48 IOE2.16
N$67  (via drill 0.5)
  Top 0.305: v58.1,51.75 56.83,51.75 56.83,60.01 43.18,60.01 D9.K
  Bottom 0.305: v58.1,51.75 IOE2.15
N$68
  Bottom 0.305: D10.K 50.16,60.01 57.47,60.01 57.47,53.02 IOE2.14
N$69
  Bottom 0.305: 59.69,54.29 IOE2.13
  Bottom 0.406: 59.69,54.29 D11.K
N$72
  Bottom 0.406: R15.1 27.3,36.2 D2.A
N$73
  Bottom 0.406: D1.A 22.86,36.2 R14.1
N$78
  Bottom 0.61: Q1.2 Q1.4 26.35,21.59 SG1.-
N$79
  Bottom 0.406: Q1.1 28.84,15.81 R27.2
N$80
  Bottom 0.406: DIS1.10 13.65,55.88 R43.1
N$82
  Bottom 0.406: R54.2 C9.1 46.04,34.39 X1.1
N$83
  Bottom 0.406: R44.1 23.81,40.32 DIS1.5
N$84
  Bottom 0.406: R36.1 36.51,40.32 DIS2.5
N$85
  Bottom 0.406: R53.2 C10.1 40.96,34.39 X1.2
N$129
  Bottom 0.406: R25.2 63.75,19.11 ENC_1.B
N$132
  Bottom 0.406: R24.2 63.75,16.45 ENC_1.A
N$139
  Bottom 0.305: ENC_1.SW- 50.48,14.99 R55.1
NRST  (via drill 0.5)
  Top 0.406: CON6.5 5.71,31.75 | 5.71,31.75 5.71,18.73 RESET.2 | v44.7,28.73 48.58,28.73 48.58,38.1 5.71,38.1 5.71,31.75
  Bottom 0.305: IC1.7 v44.7,28.73
  Bottom 0.61: C8.2 7.3,16.83 RESET.2
OSC_IN
  Bottom 0.305: 42.7,32.62 R53.1 42.7,31.59 43.7,31.59 IC1.5
OSC_OUT
  Bottom 0.305: IC1.6 44.2,32.45 R54.1
S$2
  cutout Top: 63.18,56.52 63.18,30.16 70.8,30.16 70.8,23.81 65.09,23.81 65.09,9.21 66.99,9.21 66.99,22.54 72.07,22.54 72.07,32.7 71.6,32.7 71.75,56.52
  cutout Bottom: 65.72,56.52 65.72,38.42 71.75,38.42 71.75,56.52
SINUS_A
  Bottom 0.305: CON2.12 72.07,42.47 R22.2
SINUS_B
  Bottom 0.305: CON2.14 69.85,40.64 73.98,40.64 R23.2
SWCLK  (via drill 0.5)
  Top 0.305: v37.78,22.86 33.34,22.86 v33.34,23.18
  Bottom 0.305: v37.78,22.86 37.78,23.28 IC1.37 | CON6.2 5.71,24.13 5.71,25.24 29.53,25.24 29.53,24.13 33.34,24.13 v33.34,23.18
  Bottom 0.406: R21.2 1.91,24.13 CON6.2
SWDIO  (via drill 0.5)
  Top 0.305: v42.23,19.37 42.23,19.69 37.78,19.69 37.78,21.59 v34.29,21.59
  Bottom 0.305: R20.1 7.3,25.88 30.16,25.88 30.16,24.76 34.29,24.76 v34.29,21.59 | IC1.34 42.7,19.37 v42.23,19.37
  Bottom 0.406: CON6.4 7.3,29.21 R20.1
TH_RES
  Bottom 0.305: IC1.20 51.95,25.28 53.98,27.3 60.01,27.3 60.01,24.45 CON1.5
TRIAC_1
  Bottom 0.305: IC1.18 51.13,26.28 58.5,33.65 75.25,33.65 75.25,52.63 CON2.4
TRIAC_2
  Bottom 0.305: IC1.19 51.5,25.78 58.74,33.02 75.88,33.02 75.88,55.17 CON2.2
TRIAC_3
  Bottom 0.305: IC1.16 50.38,27.28 58.02,34.92 60.33,34.92 60.33,39.37 62.87,39.37 62.87,55.17 CON2.1
TRIAC_4
  Bottom 0.305: IC1.17 50.76,26.78 58.26,34.29 60.96,34.29 60.96,38.42 63.5,38.42 63.5,52.63 CON2.3
UART_RX
  Bottom 0.305: IC1.31 44.2,12.07 38.73,12.07 CON4.2
UART_TX
  Bottom 0.305: IC1.30 44.7,11.43 41.27,11.43 CON4.3
USB_DM  (via drill 0.5)
  Top 0.305: CON5.2 60.33,12.85 60.33,13.97 54.93,13.97 54.93,13.02 v43.26,13.02
  Bottom 0.305: IC1.32 43.7,13.02 v43.26,13.02
USB_DP  (via drill 0.5)
  Top 0.305: v42.7,14.6 46.99,14.6 46.99,13.65 54.29,13.65 54.29,14.6 60.96,14.6 60.96,13.65 CON5.3
  Bottom 0.305: IC1.33 43.2,14.6 v42.7,14.6
V+  (via drill 0.5)
  Top 1.016: v15.56,11.75 v15.56,13.02 26.99,13.02 26.99,4.13 63.5,4.13 v63.5,8.89 v64.77,8.89 | CON2.13 67.31,33.65 75.25,33.65 v75.25,23.65 v75.25,22.54
  Bottom 0.61: v15.56,11.75 15.5,11.75 ST1.1 13.02,11.47 C14.1
  Bottom 0.813: 66.67,8.91 75.56,8.91 D4.K
  Bottom 1.016: CON2.11 CON2.13 | 63.5,8.91 v63.5,8.89 v64.77,8.89 66.67,8.89 66.67,8.91 66.67,22.54 v75.25,22.54 v75.25,23.65 | 15.5,11.75 15.56,11.81 v15.56,13.02 v14.29,13.02

### Text on the board
Top: 2015 | ROwen
tPlace: 2015 | ROwen